# EasyEDA schematic Schematic_SmartHome.json
TITLE: ESP32 + Power; REV: 1.0; Date: 2022-07-14; Sheet: 1/1; Drawn By: bytebane; Company: bytebane
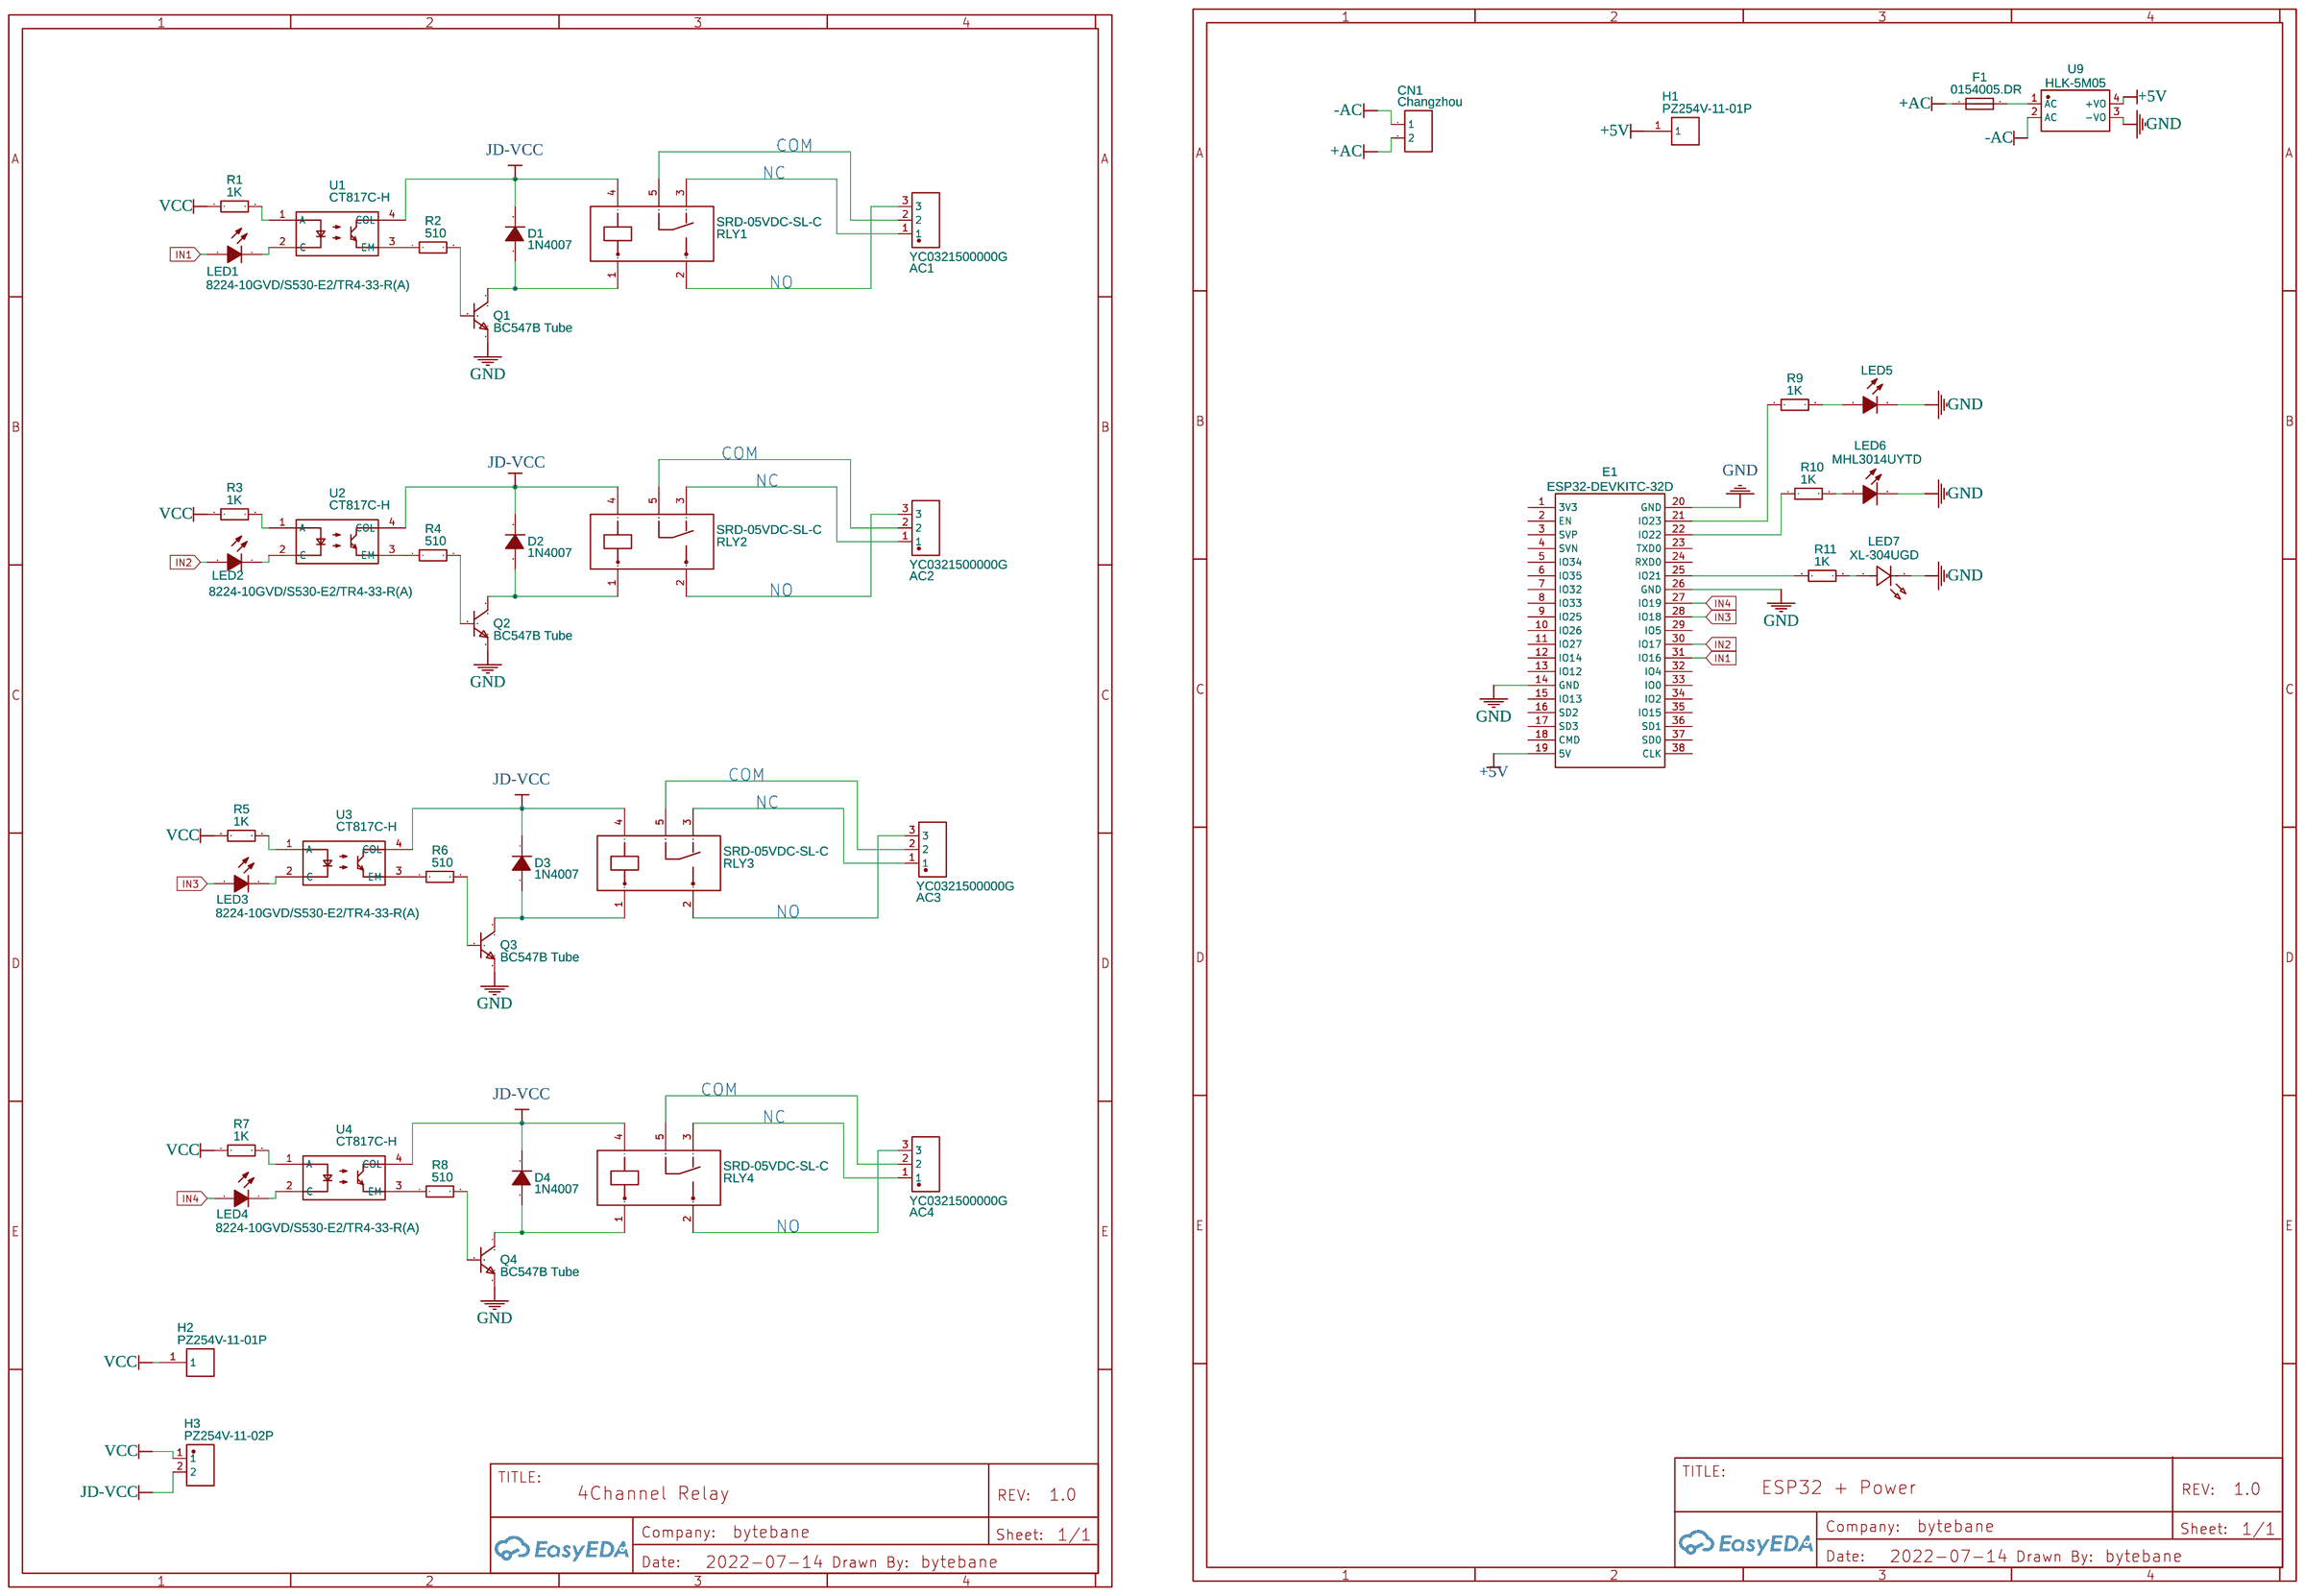
[diagram p0: schematic sheet]

## Parts
AC1  YC0321500000G  [CONN-TH_YC0321500000G]
AC2  YC0321500000G  [CONN-TH_YC0321500000G]
AC3  YC0321500000G  [CONN-TH_YC0321500000G]
AC4  YC0321500000G  [CONN-TH_YC0321500000G]
CN1  Changzhou  [CONN-TH_XT30UPB-F]
D1  1N4007  [DO-41_BD2.4-L4.7-P8.70-D0.9-RD]
D2  1N4007  [DO-41_BD2.4-L4.7-P8.70-D0.9-RD]
D3  1N4007  [DO-41_BD2.4-L4.7-P8.70-D0.9-RD]
D4  1N4007  [DO-41_BD2.4-L4.7-P8.70-D0.9-RD]
E1  ESP32-DEVKITC-32D  [ESP32-DEVKITC-32D]
F1  0154005.DR  [FUSE-SMD_L9.8-W5.1]
H1  PZ254V-11-01P  [HDR-TH_1P-P2.54-V-M]
H2  PZ254V-11-01P  [HDR-TH_1P-P2.54-V-M]
H3  PZ254V-11-02P  [HDR-TH_2P-P2.54-V-M]
LED1  8224-10GVD/S530-E2/TR4-33-R(A)  [LED-TH_BD3.8-P5.08-RD]
LED2  8224-10GVD/S530-E2/TR4-33-R(A)  [LED-TH_BD3.8-P5.08-RD]
LED3  8224-10GVD/S530-E2/TR4-33-R(A)  [LED-TH_BD3.8-P5.08-RD]
LED4  8224-10GVD/S530-E2/TR4-33-R(A)  [LED-TH_BD3.8-P5.08-RD]
LED5  8224-10GVD/S530-E2/TR4-33-R(A)  [LED-TH_BD3.8-P5.08-RD]
LED6  MHL3014UYTD  [LED-TH_BD3.9-P2.54-R-FD]
LED7  XL-304UGD  [LED-TH_BD3.8-P2.54-FD_GREEN]
Q1  BC547B Tube  [TO-92-3_L4.9-W3.7-P2.54-L]
Q2  BC547B Tube  [TO-92-3_L4.9-W3.7-P2.54-L]
Q3  BC547B Tube  [TO-92-3_L4.9-W3.7-P2.54-L]
Q4  BC547B Tube  [TO-92-3_L4.9-W3.7-P2.54-L]
R1  1K  [RES-TH_BD2.5-L6.5-P10.50-D0.6]
R2  510  [RES-TH_BD2.4-L6.3-P10.30-D0.6]
R3  1K  [RES-TH_BD2.5-L6.5-P10.50-D0.6]
R4  510  [RES-TH_BD2.4-L6.3-P10.30-D0.6]
R5  1K  [RES-TH_BD2.5-L6.5-P10.50-D0.6]
R6  510  [RES-TH_BD2.4-L6.3-P10.30-D0.6]
R7  1K  [RES-TH_BD2.5-L6.5-P10.50-D0.6]
R8  510  [RES-TH_BD2.4-L6.3-P10.30-D0.6]
R9  1K  [RES-TH_BD2.5-L6.5-P10.50-D0.6]
R10  1K  [RES-TH_BD2.5-L6.5-P10.50-D0.6]
R11  1K  [RES-TH_BD2.5-L6.5-P10.50-D0.6]
RLY1  SRD-05VDC-SL-C  [RELAY-TH_SRD-XXVDC-XL-C]
RLY2  SRD-05VDC-SL-C  [RELAY-TH_SRD-XXVDC-XL-C]
RLY3  SRD-05VDC-SL-C  [RELAY-TH_SRD-XXVDC-XL-C]
RLY4  SRD-05VDC-SL-C  [RELAY-TH_SRD-XXVDC-XL-C]
U1  CT817C-H  [DIP-4_L6.5-W4.6-P2.54-LS7.6-BL]
U2  CT817C-H  [DIP-4_L6.5-W4.6-P2.54-LS7.6-BL]
U3  CT817C-H  [DIP-4_L6.5-W4.6-P2.54-LS7.6-BL]
U4  CT817C-H  [DIP-4_L6.5-W4.6-P2.54-LS7.6-BL]
U9  HLK-5M05  [PWRM-TH_HLK-5M05]

## Library data of the parts
AC1-AC4 = YC0321500000G: Supplier: LCSC; Supplier Part: C2683166; Manufacturer: Amphenol; Contributor: LCSC; JLCPCB Part Class: Extended Part; Package Display: No
CN1 = XT30UPB-F: Supplier: LCSC; Supplier Part: C108769; Manufacturer: Changzhou Amass Elec; Contributor: LCSC; JLCPCB Part Class: Extended Part
D1-D4 = 1N4007: Supplier: LCSC; Manufacturer: SEMTECH; Supplier Part: C106903; JLCPCB Part Class: Extended Part
E1 = ESP32-DEVKITC-32D: Manufacturer: ESPRESSIF; link: https://www.tme.eu/pl/details/esp32-devkitc-32d/zestawy-do-transmisji-danych/espressif/; Contributor: pb158; Package Display: No
F1 = 0154005.DR: Supplier: LCSC; Supplier Part: C206916; Manufacturer: Littelfuse; Contributor: LCSC; JLCPCB Part Class: Extended Part
H1 H2 = PZ254V-11-01P: Supplier: LCSC; Supplier Part: C492400; Manufacturer: XFCN; Contributor: LCSC; JLCPCB Part Class: Extended Part
H3 = PZ254V-11-02P: Supplier: LCSC; Supplier Part: C492401; Manufacturer: XFCN; Contributor: LCSC; JLCPCB Part Class: Extended Part
LED1-LED4 = 8224-10GVD/S530-E2/TR4-33-R(A): Supplier: LCSC; Supplier Part: C329173; Manufacturer: Everlight Elec; Contributor: LCSC; JLCPCB Part Class: Extended Part
LED5 = 8224-10GVD/S530-E2/TR4-33-R(A): Supplier: LCSC; Supplier Part: C329173; Manufacturer: Everlight Elec; Contributor: LCSC; JLCPCB Part Class: Extended Part; Package Display: No
LED6 = MHL3014UYTD: Supplier: LCSC; Supplier Part: C409800; Manufacturer: MEIHUA; Contributor: LCSC; JLCPCB Part Class: Extended Part; Package Display: No
LED7 = XL-304UGD: Supplier: LCSC; Supplier Part: C2895477; Manufacturer: XINGLIGHT(成兴光); link: https://atta.szlcsc.com//upload/public/pdf/source/20210910/AE5C5ADBE00B44586524EDA7488041E0.pdf; Contributor: LCSC; JLCPCB Part Class: Extended Part; Package Display: No
Q1-Q4 = BC547B Tube: Supplier: LCSC; Manufacturer: CJ; Supplier Part: C2092; JLCPCB Part Class: Extended Part
R1 R3 R5 R7 R9-R11 = MFR0W4F1001A50: Supplier: LCSC; Manufacturer: UniOhm; Supplier Part: C57435; JLCPCB Part Class: Extended Part; Resistance: 1kΩ
R2 R4 R6 R8 = RNU18F5100A520NH: Supplier: LCSC; Supplier Part: C274431; Manufacturer: Futaba Elec; Contributor: LCSC; JLCPCB Part Class: Extended Part; Resistance: 510Ω
RLY1-RLY4 = SRD-05VDC-SL-C: Supplier: LCSC; Manufacturer: SONGLE; Supplier Part: C35449; JLCPCB Part Class: Extended Part
U1-U4 = CT817C-H: Supplier: LCSC; Manufacturer: CT MICRO; Contributor: LCSC; Supplier Part: C127188; JLCPCB Part Class: Extended Part
U9 = HLK-5M05: Supplier: LCSC; Supplier Part: C209907; Manufacturer: HI-LINK; Contributor: LCSC; JLCPCB Part Class: Extended Part

## Nets
+5V: E1.19(5V) H1.1 U9.4(+VO)
GND: E1.14(GND) E1.20(GND) E1.26(GND) LED5.1(K) LED6.2(-) LED7.2(K) Q1.3(E) Q2.3(E) Q3.3(E) Q4.3(E) U9.3(-VO)
VCC: H2.1 H3.1 R1.1 R3.1 R5.1 R7.1
+AC: CN1.2 F1.1
-AC: CN1.1 U9.2(AC)
IN1: E1.31(IO16) LED1.2(A)
IN2: E1.30(IO17) LED2.2(A)
IN3: E1.28(IO18) LED3.2(A)
IN4: E1.27(IO19) LED4.2(A)
JD-VCC: D1.1(K) D2.1(K) D3.1(K) D4.1(K) H3.2 RLY1.4 RLY2.4 RLY3.4 RLY4.4 U1.4(COL) U2.4(COL) U3.4(COL) U4.4(COL)
Net-(AC1-1): AC1.1 RLY1.3
Net-(AC1-2): AC1.2 RLY1.5
Net-(AC1-3): AC1.3 RLY1.2
Net-(AC2-1): AC2.1 RLY2.3
Net-(AC2-2): AC2.2 RLY2.5
Net-(AC2-3): AC2.3 RLY2.2
Net-(AC3-1): AC3.1 RLY3.3
Net-(AC3-2): AC3.2 RLY3.5
Net-(AC3-3): AC3.3 RLY3.2
Net-(AC4-1): AC4.1 RLY4.3
Net-(AC4-2): AC4.2 RLY4.5
Net-(AC4-3): AC4.3 RLY4.2
Net-(D1-2): D1.2(A) Q1.1(C) RLY1.1
Net-(D2-2): D2.2(A) Q2.1(C) RLY2.1
Net-(D3-2): D3.2(A) Q3.1(C) RLY3.1
Net-(D4-2): D4.2(A) Q4.1(C) RLY4.1
Net-(E1-21): E1.21(IO23) R9.1
Net-(E1-22): E1.22(IO22) R10.1
Net-(E1-25): E1.25(IO21) R11.1
Net-(F1-2): F1.2 U9.1(AC)
Net-(LED1-1): LED1.1(K) U1.2(C)
Net-(LED2-1): LED2.1(K) U2.2(C)
Net-(LED3-1): LED3.1(K) U3.2(C)
Net-(LED4-1): LED4.1(K) U4.2(C)
Net-(LED5-2): LED5.2(A) R9.2
Net-(LED6-1): LED6.1(+) R10.2
Net-(LED7-1): LED7.1(A) R11.2
Net-(Q1-2): Q1.2(B) R2.2
Net-(Q2-2): Q2.2(B) R4.2
Net-(Q3-2): Q3.2(B) R6.2
Net-(Q4-2): Q4.2(B) R8.2
Net-(R1-2): R1.2 U1.1(A)
Net-(R2-1): R2.1 U1.3(EM)
Net-(R3-2): R3.2 U2.1(A)
Net-(R4-1): R4.1 U2.3(EM)
Net-(R5-2): R5.2 U3.1(A)
Net-(R6-1): R6.1 U3.3(EM)
Net-(R7-2): R7.2 U4.1(A)
Net-(R8-1): R8.1 U4.3(EM)

Not connected (* = marked no-connect by the designer): E1 1(3V3) 2(EN) 3(SVP) 4(SVN) 5(IO34) 6(IO35) 7(IO32) 8(IO33) 9(IO25) 10(IO26) 11(IO27) 12(IO14) 13(IO12) 15(IO13) 16(SD2) 17(SD3) 18(CMD) 23(TXD0) 24(RXD0) 29(IO5) 32(IO4) 33(IO0) 34(IO2) 35(IO15) 36(SD1) 37(SD0) 38(CLK)

## Notes on the sheet
- COM
- NC
- NO
- COM
- NC
- NO
- COM
- NC
- NO
- COM
- NC
- NO
